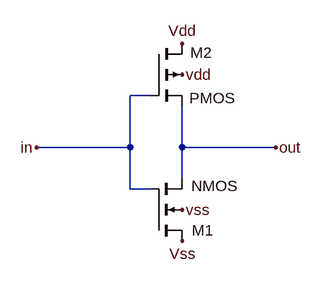
[diagram p0: schematic inv.asc]
inv.asc, the LTspice schematic file:
Version 4
SHEET 1 5984 1684
WIRE 656 -2160 624 -2160
WIRE 624 -2080 624 -2160
WIRE 624 -2080 480 -2080
WIRE 704 -2080 704 -2144
WIRE 848 -2080 704 -2080
WIRE 704 -2032 704 -2080
WIRE 624 -2016 624 -2080
WIRE 656 -2016 624 -2016
FLAG 480 -2080 in
FLAG 848 -2080 out
FLAG 704 -1984 vss
FLAG 704 -1936 Vss
FLAG 704 -2192 vdd
FLAG 704 -2240 Vdd
SYMBOL nmos4 656 -1936 M180
WINDOW 0 63 16 Left 2
WINDOW 3 62 85 Left 2
SYMATTR InstName M1
SYMATTR Value2 l=130n w=130n
SYMBOL pmos4 656 -2240 R0
WINDOW 0 61 14 Left 2
WINDOW 3 59 84 Left 2
SYMATTR InstName M2
SYMATTR Value2 l=130n w=260n

The netlist it stands for:
* inv.asc
M1 vss in out vss NMOS l=130n w=130n
M2 vdd in out vdd PMOS l=130n w=260n
.model NMOS NMOS
.model PMOS PMOS
.lib standard.mos
.backanno
.end